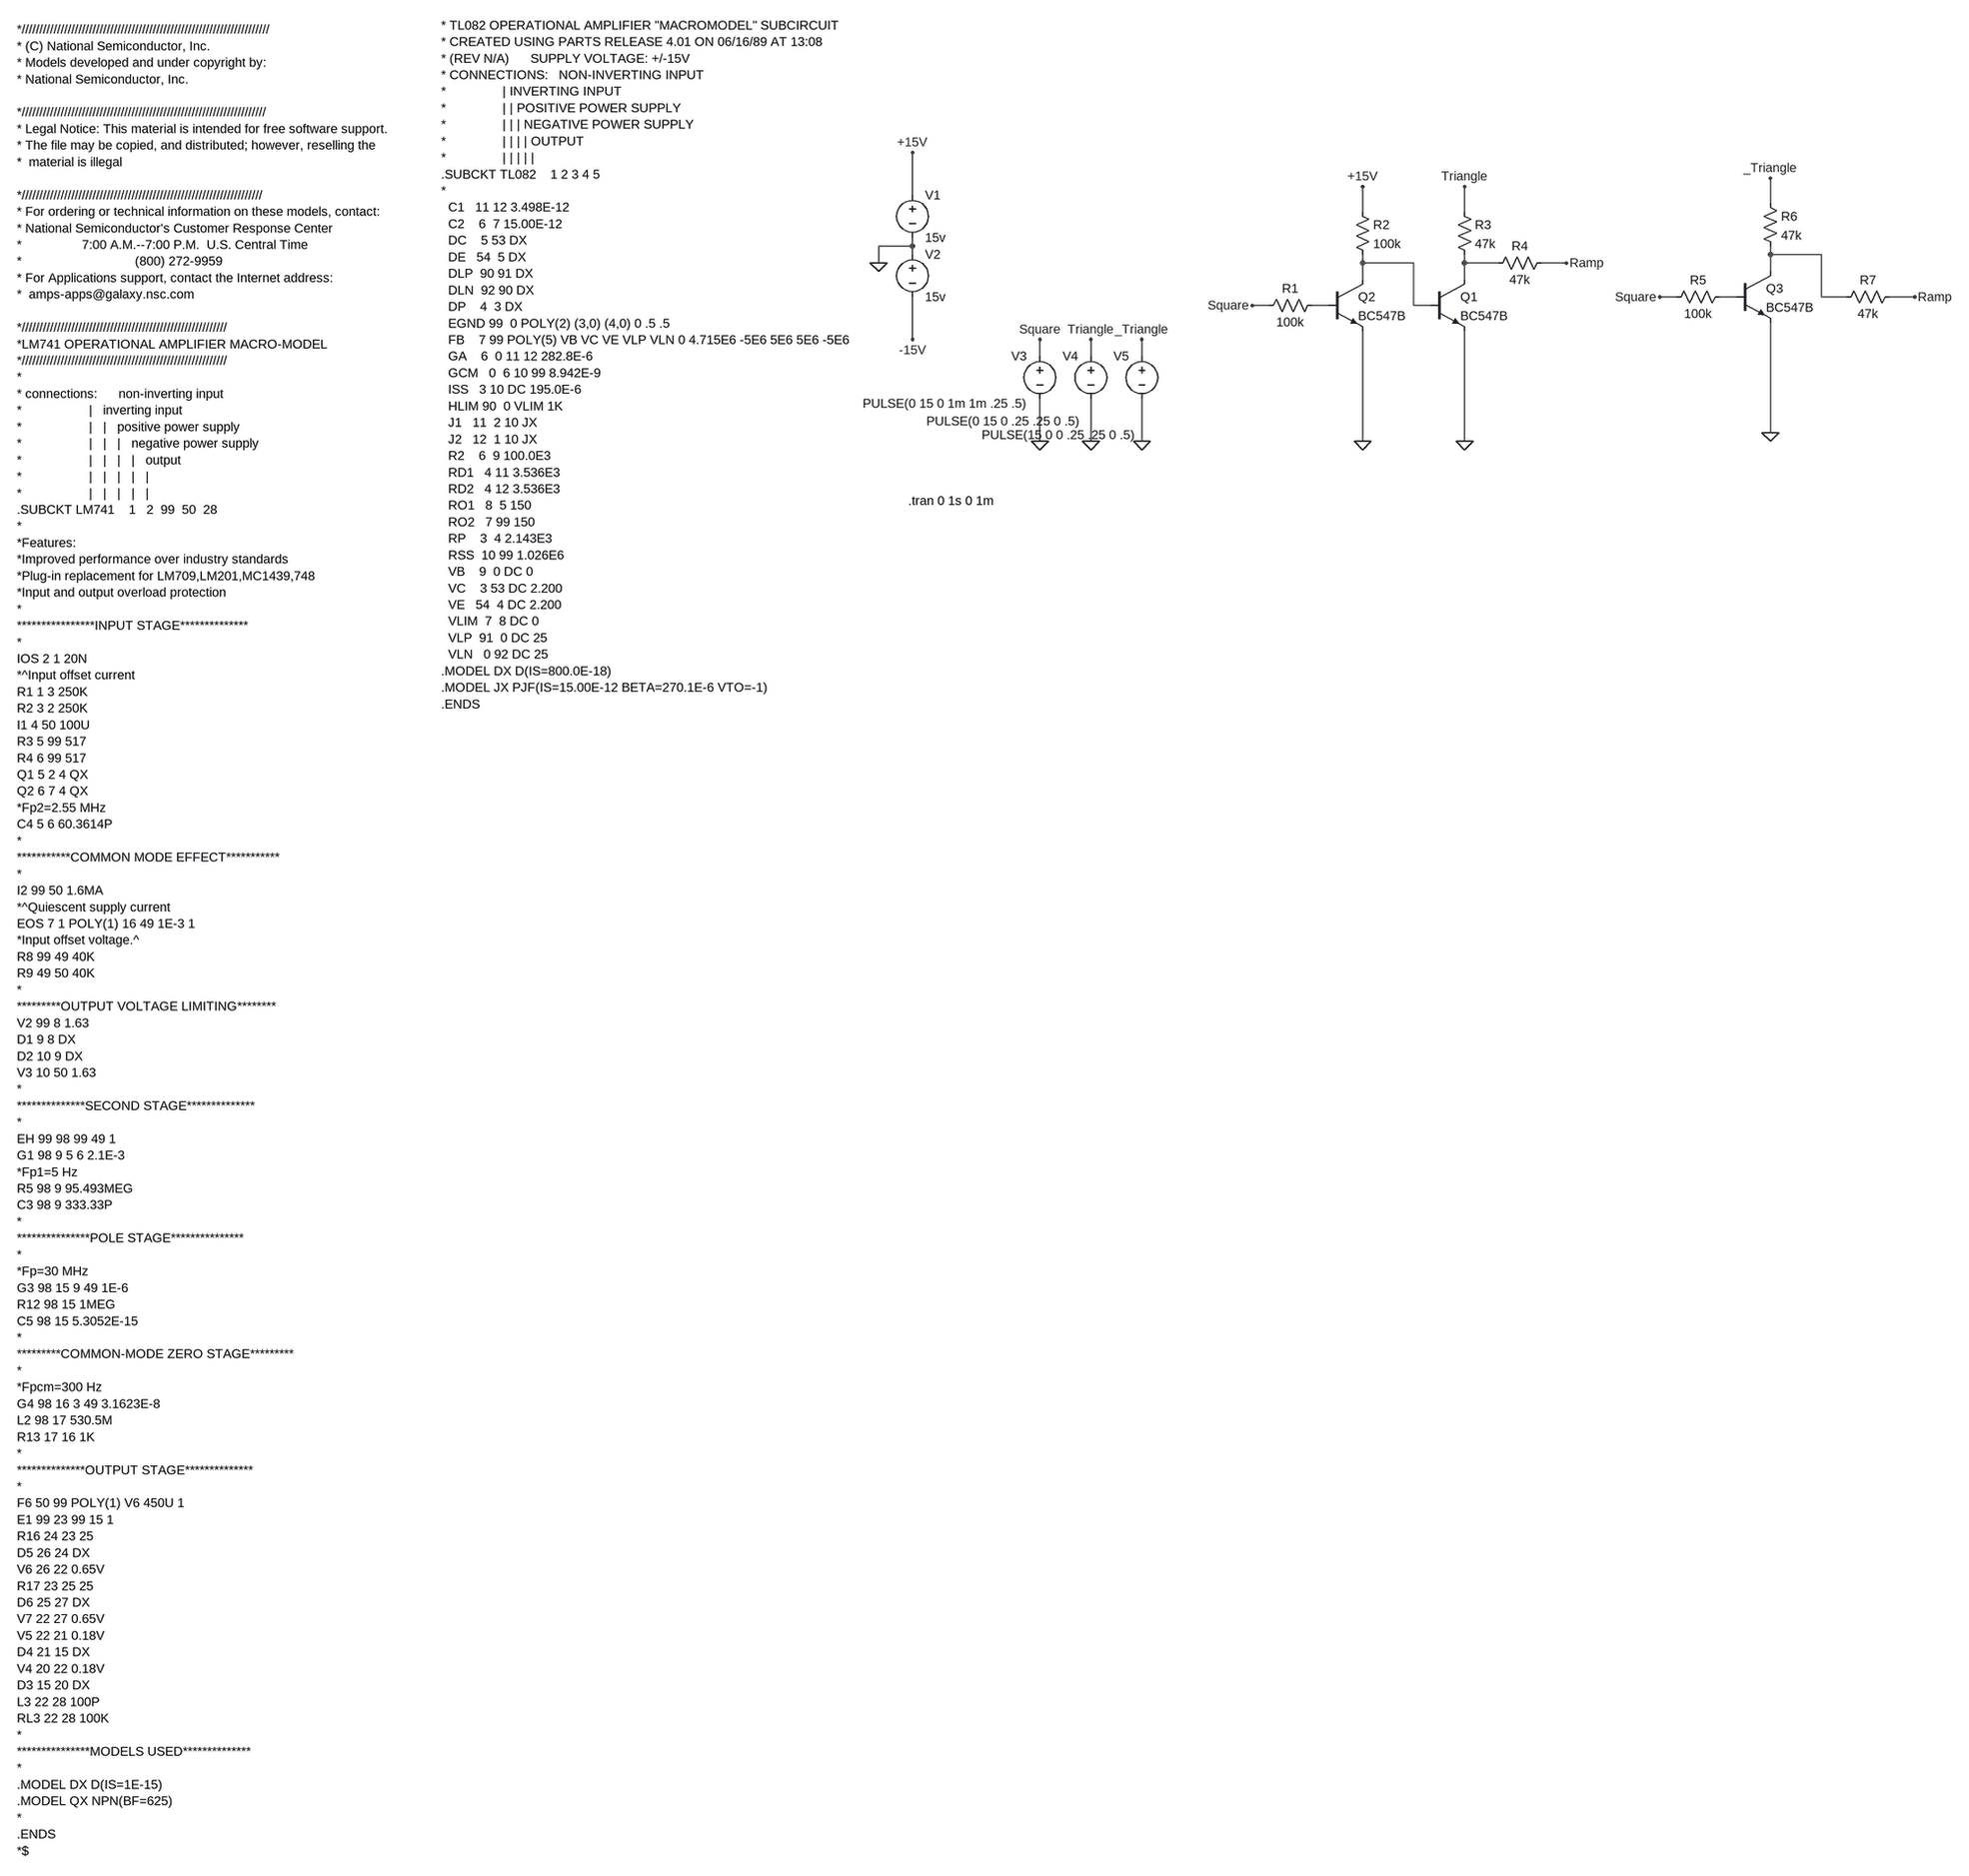
[diagram p0: schematic ramp2triangle.asc]
ramp2triangle.asc, the LTspice schematic file:
Version 4
SHEET 1 2688 2848
WIRE -784 64 -784 -16
WIRE 832 80 832 32
WIRE 64 96 64 48
WIRE 256 96 256 48
WIRE -784 160 -784 144
WIRE -784 160 -848 160
WIRE -784 176 -784 160
WIRE 832 176 832 160
WIRE 928 176 832 176
WIRE -848 192 -848 160
WIRE 64 192 64 176
WIRE 160 192 64 192
WIRE 256 192 256 176
WIRE 320 192 256 192
WIRE 448 192 400 192
WIRE 832 208 832 176
WIRE 64 224 64 192
WIRE 256 224 256 192
WIRE 656 256 624 256
WIRE 768 256 736 256
WIRE 928 256 928 176
WIRE 976 256 928 256
WIRE 1104 256 1056 256
WIRE -112 272 -144 272
WIRE 0 272 -32 272
WIRE 160 272 160 192
WIRE 192 272 160 272
WIRE -784 336 -784 256
WIRE -544 368 -544 336
WIRE -448 368 -448 336
WIRE -352 368 -352 336
WIRE 832 512 832 304
WIRE -544 528 -544 448
WIRE -448 528 -448 448
WIRE -352 528 -352 448
WIRE 64 528 64 320
WIRE 256 528 256 320
FLAG -848 192 0
FLAG -784 -16 +15V
FLAG -784 336 -15V
FLAG -544 528 0
FLAG 64 528 0
FLAG -544 336 Square
FLAG -448 528 0
FLAG -448 336 Triangle
FLAG -144 272 Square
FLAG 64 48 +15V
FLAG 832 32 _Triangle
FLAG 256 528 0
FLAG 448 192 Ramp
FLAG 832 512 0
FLAG 624 256 Square
FLAG 256 48 Triangle
FLAG 1104 256 Ramp
FLAG -352 528 0
FLAG -352 336 _Triangle
SYMBOL voltage -784 48 R0
SYMATTR InstName V1
SYMATTR Value 15v
SYMBOL voltage -784 160 R0
SYMATTR InstName V2
SYMATTR Value 15v
SYMBOL voltage -544 352 M0
WINDOW 123 0 0 Left 0
WINDOW 39 0 0 Left 0
WINDOW 3 23 105 Left 2
SYMATTR Value PULSE(0 15 0 1m 1m .25 .5)
SYMATTR InstName V3
SYMBOL npn 0 224 R0
SYMATTR InstName Q2
SYMATTR Value BC547B
SYMBOL voltage -448 352 M0
WINDOW 123 0 0 Left 0
WINDOW 39 0 0 Left 0
WINDOW 3 19 138 Left 2
SYMATTR Value PULSE(0 15 0 .25 .25 0 .5)
SYMATTR InstName V4
SYMBOL res -16 256 R90
WINDOW 0 0 56 VBottom 2
WINDOW 3 32 56 VTop 2
SYMATTR InstName R1
SYMATTR Value 100k
SYMBOL npn 192 224 R0
SYMATTR InstName Q1
SYMATTR Value BC547B
SYMBOL res 48 80 R0
SYMATTR InstName R2
SYMATTR Value 100k
SYMBOL res 240 80 R0
SYMATTR InstName R3
SYMATTR Value 47k
SYMBOL res 416 176 R90
WINDOW 0 0 56 VBottom 2
WINDOW 3 32 56 VTop 2
SYMATTR InstName R4
SYMATTR Value 47k
SYMBOL npn 768 208 R0
SYMATTR InstName Q3
SYMATTR Value BC547B
SYMBOL res 752 240 R90
WINDOW 0 0 56 VBottom 2
WINDOW 3 32 56 VTop 2
SYMATTR InstName R5
SYMATTR Value 100k
SYMBOL res 816 64 R0
SYMATTR InstName R6
SYMATTR Value 47k
SYMBOL res 1072 240 R90
WINDOW 0 0 56 VBottom 2
WINDOW 3 32 56 VTop 2
SYMATTR InstName R7
SYMATTR Value 47k
SYMBOL voltage -352 352 M0
WINDOW 123 0 0 Left 0
WINDOW 39 0 0 Left 0
WINDOW 3 11 164 Left 2
SYMATTR Value PULSE(15 0 0 .25 .25 0 .5)
SYMATTR InstName V5
TEXT -1672 -256 Left 2 !* TL082 OPERATIONAL AMPLIFIER "MACROMODEL" SUBCIRCUIT\n* CREATED USING PARTS RELEASE 4.01 ON 06/16/89 AT 13:08\n* (REV N/A)      SUPPLY VOLTAGE: +/-15V\n* CONNECTIONS:   NON-INVERTING INPUT\n*                | INVERTING INPUT\n*                | | POSITIVE POWER SUPPLY\n*                | | | NEGATIVE POWER SUPPLY\n*                | | | | OUTPUT\n*                | | | | |\n.SUBCKT TL082    1 2 3 4 5\n*\n  C1   11 12 3.498E-12\n  C2    6  7 15.00E-12\n  DC    5 53 DX\n  DE   54  5 DX\n  DLP  90 91 DX\n  DLN  92 90 DX\n  DP    4  3 DX\n  EGND 99  0 POLY(2) (3,0) (4,0) 0 .5 .5\n  FB    7 99 POLY(5) VB VC VE VLP VLN 0 4.715E6 -5E6 5E6 5E6 -5E6\n  GA    6  0 11 12 282.8E-6\n  GCM   0  6 10 99 8.942E-9\n  ISS   3 10 DC 195.0E-6\n  HLIM 90  0 VLIM 1K\n  J1   11  2 10 JX\n  J2   12  1 10 JX\n  R2    6  9 100.0E3\n  RD1   4 11 3.536E3\n  RD2   4 12 3.536E3\n  RO1   8  5 150\n  RO2   7 99 150\n  RP    3  4 2.143E3\n  RSS  10 99 1.026E6\n  VB    9  0 DC 0\n  VC    3 53 DC 2.200\n  VE   54  4 DC 2.200\n  VLIM  7  8 DC 0\n  VLP  91  0 DC 25\n  VLN   0 92 DC 25\n.MODEL DX D(IS=800.0E-18)\n.MODEL JX PJF(IS=15.00E-12 BETA=270.1E-6 VTO=-1)\n.ENDS
TEXT -792 640 Left 2 !.tran 0 1s 0 1m
TEXT -2496 -248 Left 2 !*//////////////////////////////////////////////////////////////////////\n* (C) National Semiconductor, Inc.\n* Models developed and under copyright by:\n* National Semiconductor, Inc.  \n \n*/////////////////////////////////////////////////////////////////////\n* Legal Notice: This material is intended for free software support.\n* The file may be copied, and distributed; however, reselling the \n*  material is illegal\n \n*////////////////////////////////////////////////////////////////////\n* For ordering or technical information on these models, contact:\n* National Semiconductor's Customer Response Center\n*                 7:00 A.M.--7:00 P.M.  U.S. Central Time\n*                                (800) 272-9959\n* For Applications support, contact the Internet address:\n*  amps-apps@galaxy.nsc.com\n \n*//////////////////////////////////////////////////////////\n*LM741 OPERATIONAL AMPLIFIER MACRO-MODEL\n*//////////////////////////////////////////////////////////\n*\n* connections:      non-inverting input\n*                   |   inverting input\n*                   |   |   positive power supply\n*                   |   |   |   negative power supply\n*                   |   |   |   |   output\n*                   |   |   |   |   |\n*                   |   |   |   |   |\n.SUBCKT LM741    1   2  99  50  28\n*\n*Features:\n*Improved performance over industry standards\n*Plug-in replacement for LM709,LM201,MC1439,748\n*Input and output overload protection\n*\n****************INPUT STAGE**************\n*\nIOS 2 1 20N\n*^Input offset current\nR1 1 3 250K\nR2 3 2 250K\nI1 4 50 100U\nR3 5 99 517\nR4 6 99 517\nQ1 5 2 4 QX\nQ2 6 7 4 QX\n*Fp2=2.55 MHz\nC4 5 6 60.3614P\n*\n***********COMMON MODE EFFECT***********\n*\nI2 99 50 1.6MA\n*^Quiescent supply current\nEOS 7 1 POLY(1) 16 49 1E-3 1\n*Input offset voltage.^\nR8 99 49 40K\nR9 49 50 40K\n*\n*********OUTPUT VOLTAGE LIMITING********\nV2 99 8 1.63\nD1 9 8 DX\nD2 10 9 DX\nV3 10 50 1.63\n*\n**************SECOND STAGE**************\n*\nEH 99 98 99 49 1\nG1 98 9 5 6 2.1E-3\n*Fp1=5 Hz\nR5 98 9 95.493MEG\nC3 98 9 333.33P\n*\n***************POLE STAGE***************\n*\n*Fp=30 MHz\nG3 98 15 9 49 1E-6\nR12 98 15 1MEG\nC5 98 15 5.3052E-15\n*\n*********COMMON-MODE ZERO STAGE*********\n*\n*Fpcm=300 Hz\nG4 98 16 3 49 3.1623E-8\nL2 98 17 530.5M\nR13 17 16 1K\n*\n**************OUTPUT STAGE**************\n*\nF6 50 99 POLY(1) V6 450U 1\nE1 99 23 99 15 1\nR16 24 23 25\nD5 26 24 DX\nV6 26 22 0.65V\nR17 23 25 25\nD6 25 27 DX\nV7 22 27 0.65V\nV5 22 21 0.18V\nD4 21 15 DX\nV4 20 22 0.18V\nD3 15 20 DX\nL3 22 28 100P\nRL3 22 28 100K\n*\n***************MODELS USED**************\n*\n.MODEL DX D(IS=1E-15)\n.MODEL QX NPN(BF=625)\n*\n.ENDS\n*$

The netlist it stands for:
* ramp2triangle.asc
V1 +15V 0 15v
V2 0 -15V 15v
V3 Square 0 PULSE(0 15 0 1m 1m .25 .5)
Q2 N002 N005 0 0 BC547B
V4 Triangle 0 PULSE(0 15 0 .25 .25 0 .5)
R1 N005 Square 100k
Q1 N003 N002 0 0 BC547B
R2 +15V N002 100k
R3 Triangle N003 47k
R4 Ramp N003 47k
Q3 N001 N004 0 0 BC547B
R5 N004 Square 100k
R6 _Triangle N001 47k
R7 Ramp N001 47k
V5 _Triangle 0 PULSE(15 0 0 .25 .25 0 .5)
.model NPN NPN
.model PNP PNP
.lib standard.bjt
* TL082 OPERATIONAL AMPLIFIER "MACROMODEL" SUBCIRCUIT
* CREATED USING PARTS RELEASE 4.01 ON 06/16/89 AT 13:08
* (REV N/A)      SUPPLY VOLTAGE: +/-15V
* CONNECTIONS:   NON-INVERTING INPUT
*                | INVERTING INPUT
*                | | POSITIVE POWER SUPPLY
*                | | | NEGATIVE POWER SUPPLY
*                | | | | OUTPUT
*                | | | | |
.SUBCKT TL082    1 2 3 4 5
*
  C1   11 12 3.498E-12
  C2    6  7 15.00E-12
  DC    5 53 DX
  DE   54  5 DX
  DLP  90 91 DX
  DLN  92 90 DX
  DP    4  3 DX
  EGND 99  0 POLY(2) (3,0) (4,0) 0 .5 .5
  FB    7 99 POLY(5) VB VC VE VLP VLN 0 4.715E6 -5E6 5E6 5E6 -5E6
  GA    6  0 11 12 282.8E-6
  GCM   0  6 10 99 8.942E-9
  ISS   3 10 DC 195.0E-6
  HLIM 90  0 VLIM 1K
  J1   11  2 10 JX
  J2   12  1 10 JX
  R2    6  9 100.0E3
  RD1   4 11 3.536E3
  RD2   4 12 3.536E3
  RO1   8  5 150
  RO2   7 99 150
  RP    3  4 2.143E3
  RSS  10 99 1.026E6
  VB    9  0 DC 0
  VC    3 53 DC 2.200
  VE   54  4 DC 2.200
  VLIM  7  8 DC 0
  VLP  91  0 DC 25
  VLN   0 92 DC 25
.MODEL DX D(IS=800.0E-18)
.MODEL JX PJF(IS=15.00E-12 BETA=270.1E-6 VTO=-1)
.ENDS
.tran 0 1s 0 1m
*//////////////////////////////////////////////////////////////////////
* (C) National Semiconductor, Inc.
* Models developed and under copyright by:
* National Semiconductor, Inc.
*/////////////////////////////////////////////////////////////////////
* Legal Notice: This material is intended for free software support.
* The file may be copied, and distributed; however, reselling the
*  material is illegal
*////////////////////////////////////////////////////////////////////
* For ordering or technical information on these models, contact:
* National Semiconductor's Customer Response Center
*                 7:00 A.M.--7:00 P.M.  U.S. Central Time
*                                (800) 272-9959
* For Applications support, contact the Internet address:
*  amps-apps@galaxy.nsc.com
*//////////////////////////////////////////////////////////
*LM741 OPERATIONAL AMPLIFIER MACRO-MODEL
*//////////////////////////////////////////////////////////
*
* connections:      non-inverting input
*                   |   inverting input
*                   |   |   positive power supply
*                   |   |   |   negative power supply
*                   |   |   |   |   output
*                   |   |   |   |   |
*                   |   |   |   |   |
.SUBCKT LM741    1   2  99  50  28
*
*Features:
*Improved performance over industry standards
*Plug-in replacement for LM709,LM201,MC1439,748
*Input and output overload protection
*
****************INPUT STAGE**************
*
IOS 2 1 20N
*^Input offset current
R1 1 3 250K
R2 3 2 250K
I1 4 50 100U
R3 5 99 517
R4 6 99 517
Q1 5 2 4 QX
Q2 6 7 4 QX
*Fp2=2.55 MHz
C4 5 6 60.3614P
*
***********COMMON MODE EFFECT***********
*
I2 99 50 1.6MA
*^Quiescent supply current
EOS 7 1 POLY(1) 16 49 1E-3 1
*Input offset voltage.^
R8 99 49 40K
R9 49 50 40K
*
*********OUTPUT VOLTAGE LIMITING********
V2 99 8 1.63
D1 9 8 DX
D2 10 9 DX
V3 10 50 1.63
*
**************SECOND STAGE**************
*
EH 99 98 99 49 1
G1 98 9 5 6 2.1E-3
*Fp1=5 Hz
R5 98 9 95.493MEG
C3 98 9 333.33P
*
***************POLE STAGE***************
*
*Fp=30 MHz
G3 98 15 9 49 1E-6
R12 98 15 1MEG
C5 98 15 5.3052E-15
*
*********COMMON-MODE ZERO STAGE*********
*
*Fpcm=300 Hz
G4 98 16 3 49 3.1623E-8
L2 98 17 530.5M
R13 17 16 1K
*
**************OUTPUT STAGE**************
*
F6 50 99 POLY(1) V6 450U 1
E1 99 23 99 15 1
R16 24 23 25
D5 26 24 DX
V6 26 22 0.65V
R17 23 25 25
D6 25 27 DX
V7 22 27 0.65V
V5 22 21 0.18V
D4 21 15 DX
V4 20 22 0.18V
D3 15 20 DX
L3 22 28 100P
RL3 22 28 100K
*
***************MODELS USED**************
*
.MODEL DX D(IS=1E-15)
.MODEL QX NPN(BF=625)
*
.ENDS
*$
.backanno
.end